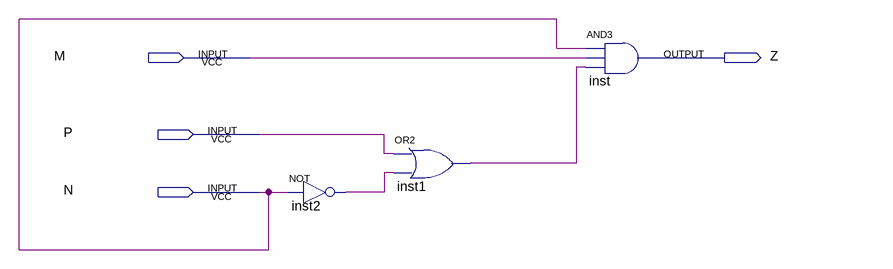
[diagram p0: schematic sheet]
// Quartus schematic LetraE.bdf as structural Verilog: 3 symbols, 4 pins
module LetraE (
  input  M,
  input  P,
  input  N,
  output Z
);

  wire inst1_out, inst2_out;

  not inst2 (inst2_out, N);
  or inst1 (inst1_out, P, inst2_out);
  and inst (Z, N, M, inst1_out);
endmodule
